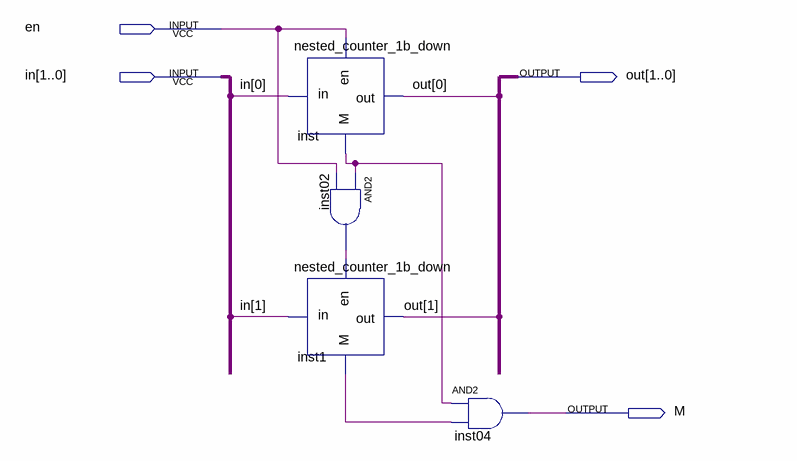
[diagram p0: schematic sheet]
// Quartus schematic nested_counter_2b_down.bdf as structural Verilog: 4 symbols, 4 pins
module nested_counter_2b_down (
  input  en,
  input  [1:0] in,
  output [1:0] out,
  output M
);

  wire inst1_m, inst02_out, inst_m;

  nested_counter_1b_down inst (.en(en), .in(in[0]), .out(out[0]), .M(inst_m));
  and inst02 (inst02_out, inst_m, en);
  nested_counter_1b_down inst1 (.en(inst02_out), .in(in[1]), .out(out[1]), .M(inst1_m));
  and inst04 (M, inst_m, inst1_m);
endmodule
